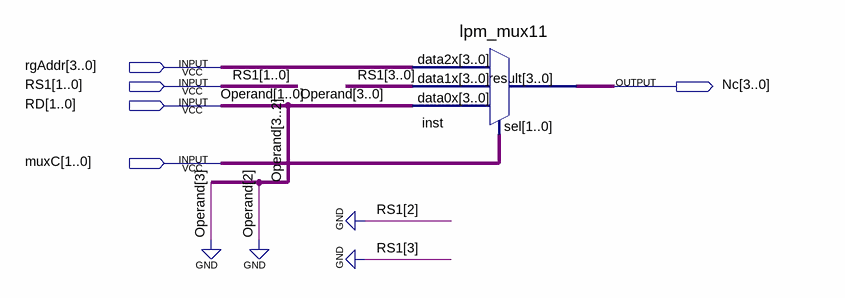
[diagram p0: schematic sheet]
// Quartus schematic muxC.bdf as structural Verilog: 1 symbols, 5 pins
module muxC (
  input  [3:0] rgAddr,
  input  [1:0] RS1,
  input  [1:0] RD,
  input  [1:0] muxC,
  output [3:0] Nc
);

  lpm_mux11 inst (.data2x(rgAddr), .data1x({2'b00, RS1}), .data0x({2'b00, RD}), .sel(muxC), .result(Nc));

  // Other names for the same wires on the sheet: Operand[1:0] = RD
endmodule
